# Altium schematic sheet Stepper_Driver_Sheet4.SchDoc
size 420 x 297 mm; SheetNumber: 10; SheetTotal: 14
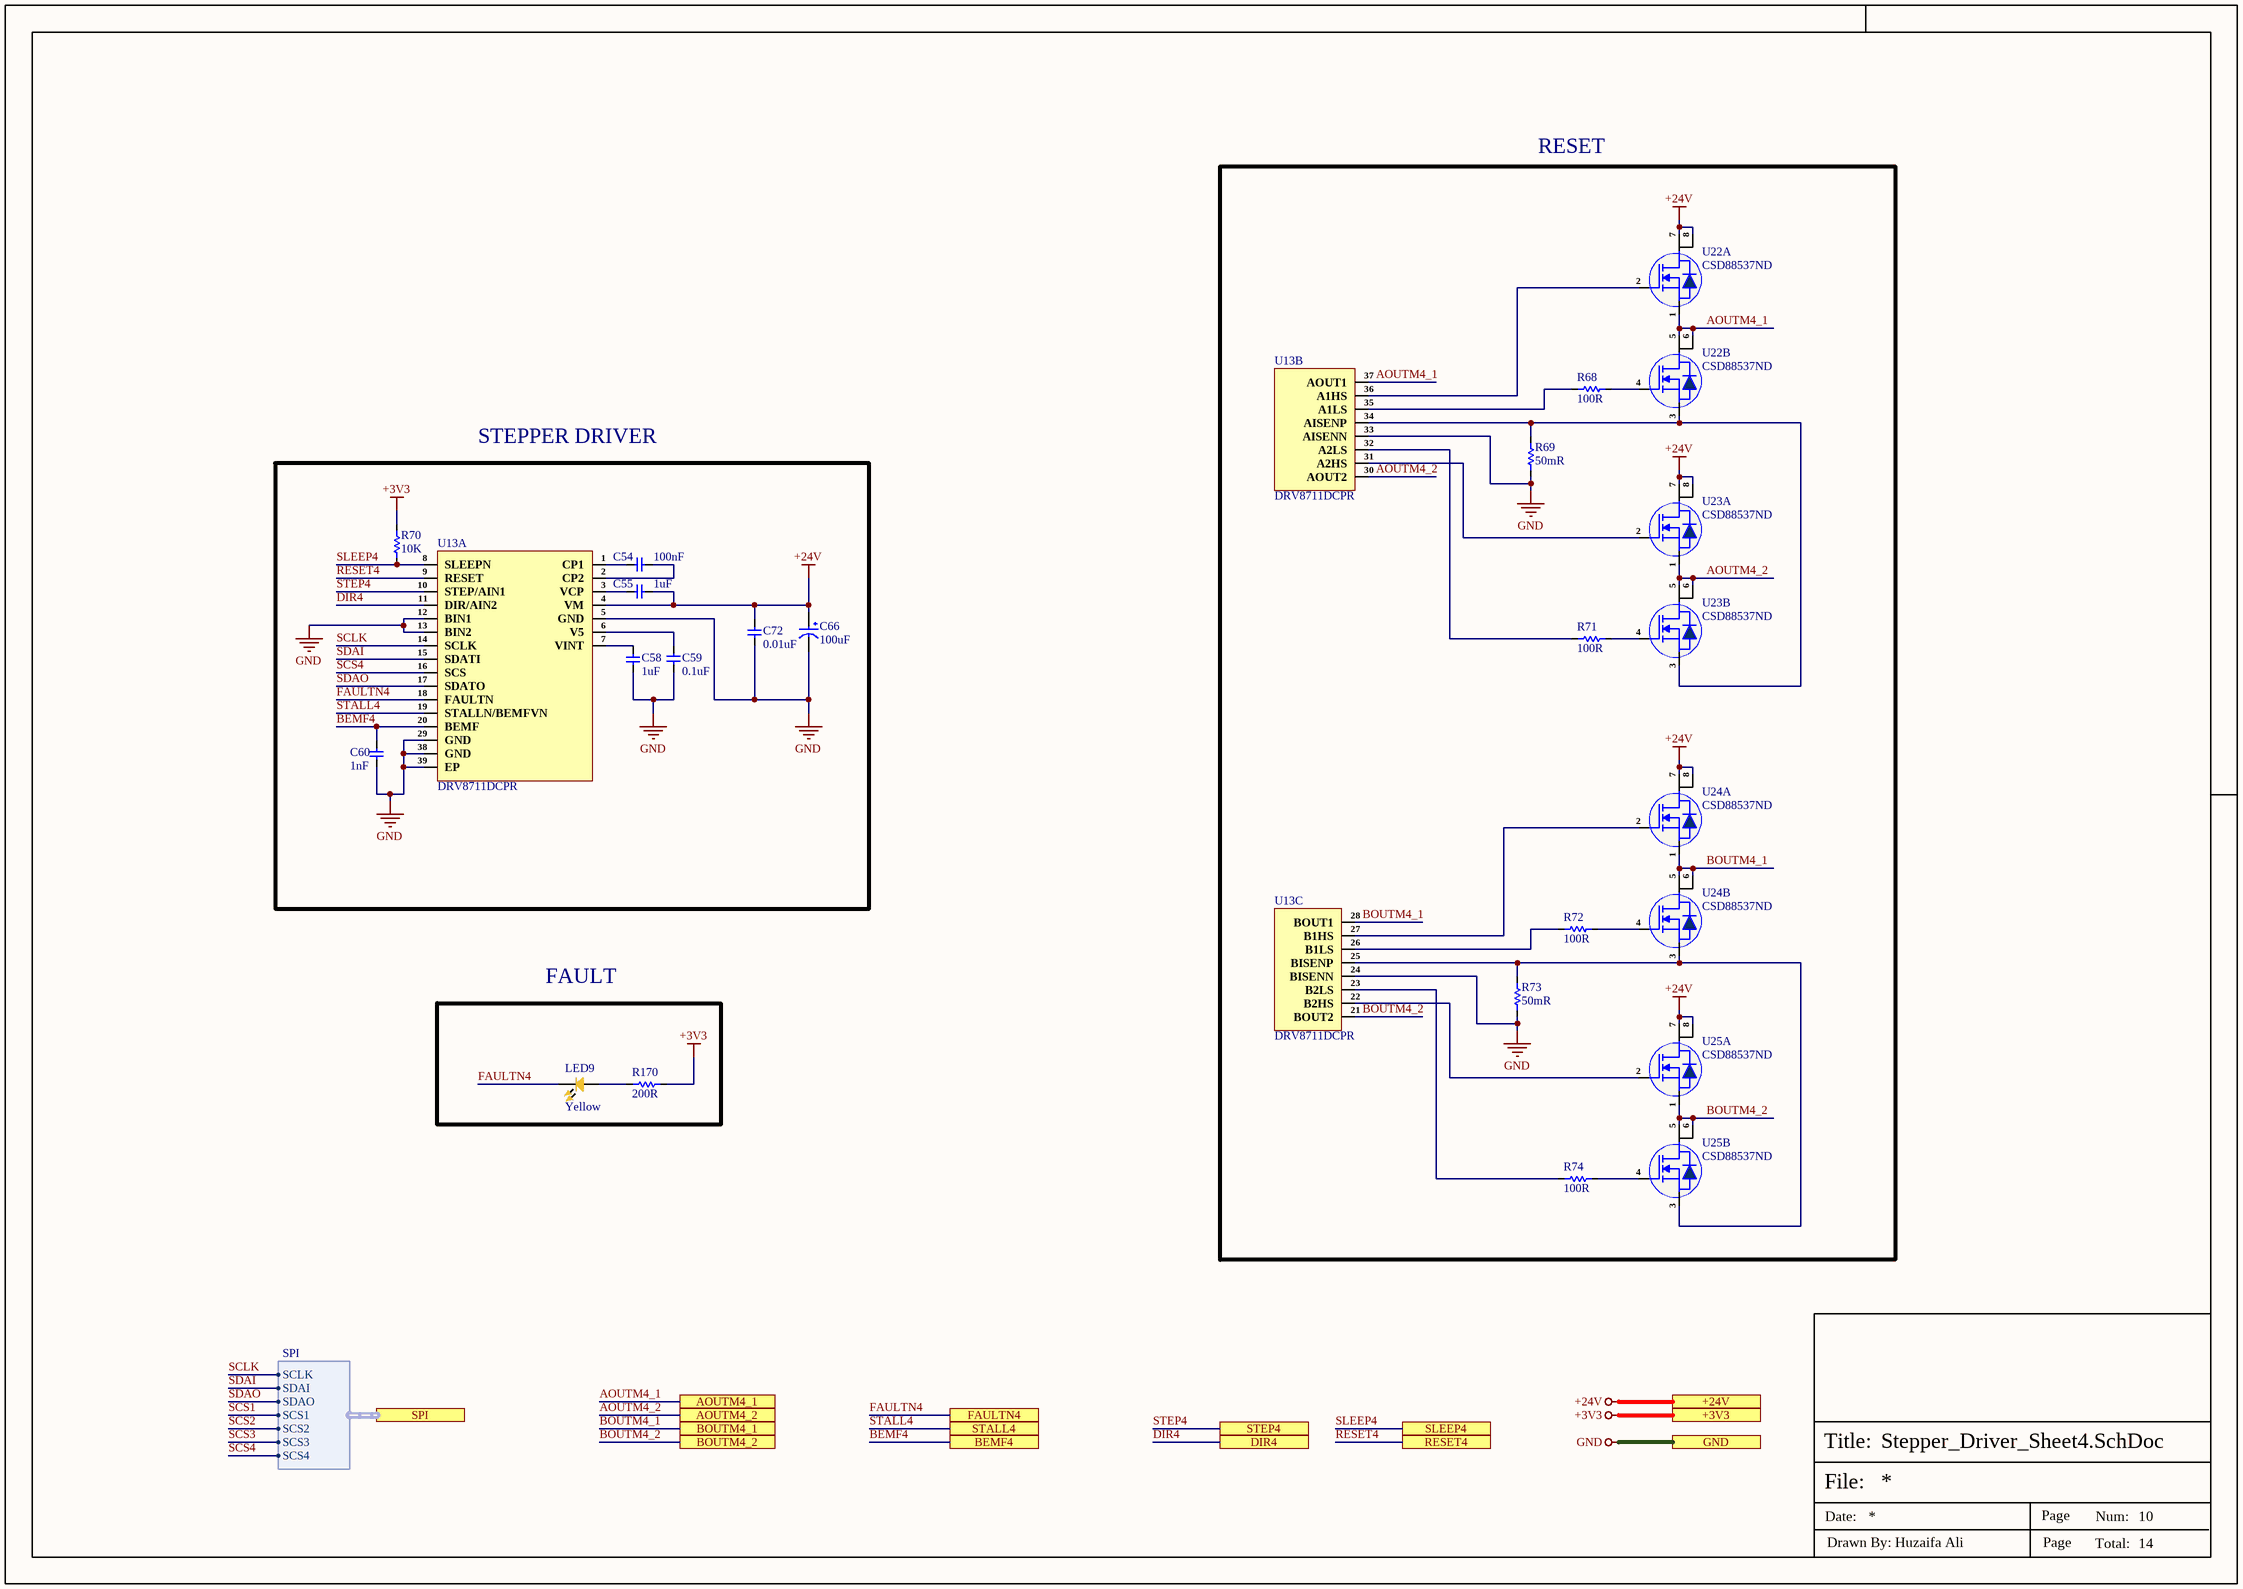
[diagram p0: Stepper_Driver_Sheet4.SchDoc]

## Parts
C54  100nF  [cap-0402]
C55  1uF  [Cap-0402]
C58  1uF  [Cap-0402]
C59  0.1uF  [Cap-0402]
C60  1nF  [Cap-0402]
C66  100uF  [UWT1H101MNL1GS_]
C72  0.01uF  [Cap-0603]
LED9  Yellow  [LED-0603]
R68  100R  [Res-0402]
R69  50mR  [RES-2010]
R70  10K  [Res-0402]
R71  100R  [Res-0402]
R72  100R  [Res-0402]
R73  50mR  [RES-2010]
R74  100R  [Res-0402]
R170  200R  [Res-0402]
U13  DRV8711DCPR  [HTSSOP-38-EP-4.4mm]  (parts A,B,C of 3)
U22  CSD88537ND  [SOIC-8]  (parts A,B of 2)
U23  CSD88537ND  [SOIC-8]  (parts A,B of 2)
U24  CSD88537ND  [SOIC-8]  (parts A,B of 2)
U25  CSD88537ND  [SOIC-8]  (parts A,B of 2)

## Blocks framed on the sheet
RESET: R68 R69 R71-R74 U13 U22-U25
STEPPER DRIVER: C54 C55 C58-C60 C66 C72 R70 U13
FAULT: LED9 R170

## Ports
+3V3 (see Top_Sheet[6B], CAN_Sheet[5D], Controller_Sheet[5D], EtherCAT_Sheet[5D], GPIO_EXPANDER_Sheet[5D], Power_Sheet[5D], RJ45_Sheet[5D], RS485_RS232_Sheet[2D], Stepper_Driver_Sheet1[5D], Stepper_Driver_Sheet2[5D], Stepper_Driver_Sheet3[5D]), +24V (see Top_Sheet[6B], Connector_Sheet[5D], Power_Sheet[5D], Stepper_Driver_Sheet1[5D], Stepper_Driver_Sheet2[5D], Stepper_Driver_Sheet3[5D]), AOUTM4_1 (see Top_Sheet[6B], Connector_Sheet[2D]), AOUTM4_2 (see Top_Sheet[6B], Connector_Sheet[2D]), BEMF4 (see Top_Sheet[6B], Controller_Sheet[4D]), BOUTM4_1 (see Top_Sheet[6C], Connector_Sheet[2D]), BOUTM4_2 (see Top_Sheet[6C], Connector_Sheet[2D]), DIR4 (see Top_Sheet[6B], Controller_Sheet[4D]), FAULTN4 (see Top_Sheet[6B], GPIO_EXPANDER_Sheet[2D]), GND (see Top_Sheet[6B], CAN_Sheet[5D], Connector_Sheet[5D], Controller_Sheet[5D], DIO_Isolation_Sheet[5D], EtherCAT_Sheet[5D], GPIO_EXPANDER_Sheet[5D], Power_Sheet[5D], RJ45_Sheet[5D], RS485_RS232_Sheet[2D], Stepper_Driver_Sheet1[5D], Stepper_Driver_Sheet2[5D], Stepper_Driver_Sheet3[5D]), RESET4 (see Top_Sheet[6B], GPIO_EXPANDER_Sheet[3D]), SLEEP4 (see Top_Sheet[6C], GPIO_EXPANDER_Sheet[3D]), SPI (harness SPI, see Top_Sheet[6B], Controller_Sheet[1D], GPIO_EXPANDER_Sheet[1D], Stepper_Driver_Sheet1[1D], Stepper_Driver_Sheet2[1D], Stepper_Driver_Sheet3[1D]), STALL4 (see Top_Sheet[6B], GPIO_EXPANDER_Sheet[2D]), STEP4 (see Top_Sheet[6B], Controller_Sheet[4D])

## Harnesses
SPI: SCLK, SDAI, SDAO, SCS1, SCS2, SCS3, SCS4

## Nets
+3V3: R70.1 R170.2 ; port +3V3
+24V: C55.2 C66.1 C72.2 U13.4(VM) U22.7(D1) U22.8(D1) U23.7(D1) U23.8(D1) U24.7(D1) U24.8(D1) U25.7(D1) U25.8(D1) ; port +24V
GND: C58.1 C59.2 C60.1 C66.2 C72.1 R69.1 R73.1 U13.5(GND) U13.12(BIN1) U13.13(BIN2) U13.24(BISENN) U13.29(GND) U13.33(AISENN) U13.38(GND) U13.39(EP) ; port GND
AOUTM4_1: U13.37(AOUT1) U22.1(S1) U22.5(D2) U22.6(D2) ; port AOUTM4_1
AOUTM4_2: U13.30(AOUT2) U23.1(S1) U23.5(D2) U23.6(D2) ; port AOUTM4_2
BEMF4: C60.2 U13.20(BEMF) ; port BEMF4
BOUTM4_1: U13.28(BOUT1) U24.1(S1) U24.5(D2) U24.6(D2) ; port BOUTM4_1
BOUTM4_2: U13.21(BOUT2) U25.1(S1) U25.5(D2) U25.6(D2) ; port BOUTM4_2
DIR4: U13.11(DIR/AIN2) ; port DIR4
FAULTN4: LED9.2 U13.18(FAULTN) ; port FAULTN4
RESET4: U13.9(RESET) ; port RESET4
SCLK: U13.14(SCLK) ; port SPI.SCLK
SCS1: port SPI.SCS1
SCS2: port SPI.SCS2
SCS3: port SPI.SCS3
SCS4: U13.16(SCS) ; port SPI.SCS4
SDAI: U13.15(SDATI) ; port SPI.SDAI
SDAO: U13.17(SDATO) ; port SPI.SDAO
SLEEP4: R70.2 U13.8(SLEEPN) ; port SLEEP4
STALL4: U13.19(STALLN/BEMFVN) ; port STALL4
STEP4: U13.10(STEP/AIN1) ; port STEP4
NetC54_1: C54.1 U13.1(CP1)
NetC54_2: C54.2 U13.2(CP2)
NetC55_1: C55.1 U13.3(VCP)
NetC58_2: C58.2 U13.7(VINT)
NetC59_1: C59.1 U13.6(V5)
NetLED9_1: LED9.1 R170.1
NetR68_1: R68.1 U13.35(A1LS)
NetR68_2: R68.2 U22.4(G4)
NetR69_2: R69.2 U13.34(AISENP) U22.3(S2) U23.3(S2)
NetR71_1: R71.1 U13.32(A2LS)
NetR71_2: R71.2 U23.4(G4)
NetR72_1: R72.1 U13.26(B1LS)
NetR72_2: R72.2 U24.4(G4)
NetR73_2: R73.2 U13.25(BISENP) U24.3(S2) U25.3(S2)
NetR74_1: R74.1 U13.23(B2LS)
NetR74_2: R74.2 U25.4(G4)
NetU13_22: U13.22(B2HS) U25.2(G1)
NetU13_27: U13.27(B1HS) U24.2(G1)
NetU13_31: U13.31(A2HS) U23.2(G1)
NetU13_36: U13.36(A1HS) U22.2(G1)

## Notes on the sheet
- File:
- Title:
- Date:
- Page
- Num:
- Total:
- Drawn By: Huzaifa Ali

## Library data of the parts
C54 = C1005X7R1H104KT000F: CAP CER 0.1UF 50V X7R 0402; Manufacturer: TDK; Tolerance: 10%; Voltage: 25V; Item Type: Capacitor; Supplier 1: Avnet; Manufacturer Part Number: C1005X7R1H104KT000F; RoHS: No; Category: Ceramic Capacitors; Dielectric: X7R; Supplier Part Number 1: C1005X7R1H104KT000F; LCSC Part Number: C361198; ComponentLink1Description: LCSC; ComponentLink1URL: https://www.lcsc.com/product-detail/Multilayer-Ceramic-Capacitors-MLCC-SMD-SMT_TDK-C1005X7R1H104KT000F_C361198.html
C55 C58 = CC0402KRX5R6BB105: CAP CER 1UF 10V X5R 0402; Manufacturer: Yageo; Tolerance: 10%; Dissipation Factor: 15%; Item Type: Capacitor; Supplier 1: Mouser; Manufacturer Part Number: CC0402KRX5R6BB105; RoHS: Yes; Category: Ceramic Capacitors; Stock 1: 6711367; Pricing 1: 1=0.11000, 10=0.05500, 50=0.05500, 100=0.03300, 500=0.02700, 1000=0.02200, 2500=0.02100, 10000=0.01800 (USD); Mount: Surface Mount; Case/Package: 0402; Number of Pins: 2; Case Code (Metric): 1005; Case Code (Imperial): 0402; Min Operating Temperature: -55°C; Max Operating Temperature: 85°C; Capacitance: 1uF; Dielectric: X5R; Package Quantity: 1; Voltage Rating: 10V; Packaging: Tape and Reel; Voltage Rating (DC): 10V; Termination: SMD/SMT; Resistor Type: Ceramic; Series: CC; Construction: Flat; Length: 1mm; Width: 0.02inch; Height: 0.5mm; Thickness: 0.022inch; Depth: 0.5mm; Radiation Hardening: No; REACH SVHC: No SVHC; Lead Free: Lead Free; Halogen Free: Halogen Free; RoHS Compliant: Yes; ComponentLink1URL: https://datasheet.ciiva.com/176/upy-gphc-x5r-4v-to-50v-12-176704.pdf?src-supplier=Digi-Key; ComponentLink1Description: https://datasheet.ciiva.com/176/upy-gphc-x5r-4v-to-50v-12-176704.pdf?src-supplier=Digi-Key; ComponentLink2URL: https://datasheet.ciiva.com/176/mlccorderingcode-176705.pdf?src-supplier=Digi-Key; ComponentLink2Description: https://datasheet.ciiva.com/176/mlccorderingcode-176705.pdf?src-supplier=Digi-Key; ComponentLink3URL: https://datasheet.ciiva.com/176/mlccorderingcode-176706.pdf?src-supplier=Digi-Key; ComponentLink3Description: https://datasheet.ciiva.com/176/mlccorderingcode-176706.pdf?src-supplier=Digi-Key; Supplier Part Number 1: 603-CC402KRX5R6BB105; LCSC Part Number: C106254
C59 = CC0402JRX7R7BB104: CAP CER 0.1UF 16V X7R 0402; Manufacturer: Yageo; Material: 4241ConductorMaterial; Value: 100nF; Tolerance: 5%; Item Type: Capacitor; Supplier: Digikey; Supplier Part Number: 311-1676-1-ND; Manufacturer Part Number: CC0402JRX7R7BB104; RoHS: Yes; Category: Ceramic Capacitors; Stock: 1659111; Pricing: 1=0.1, 10=0.046, 50=0.0262, 100=0.0203, 500=0.01528, 1000=0.012, 2500=0.01091, 5000=0.01004 (USD); Mounting Technology: Surface Mount; Case/Package: 0402; Case Code (Metric): 1005; Case Code (Imperial): 0402; Min Operating Temperature: -55°C; Max Operating Temperature: 125°C; Dielectric: X7R; Packaging: Tape and Reel; Package Quantity: 10000; Voltage Rating (DC): 16V; Voltage Rating: 16V; Series: CC; Construction: Flat; Length: 0.039inch; Width: 0.02inch; Height: 0.5mm; Thickness: 0.022inch; Lead Free: Lead Free; Halogen Free: Halogen Free; RoHS Compliant: Yes; ComponentLink1URL: https://datasheet.ciiva.com/13210/upy-gphc-x7r-6-3v-to-50v-8-12304-13210152.pdf?src-supplier=Mouser; ComponentLink1Description: https://datasheet.ciiva.com/13210/upy-gphc-x7r-6-3v-to-50v-8-12304-13210152.pdf?src-supplier=Mouser; LCSC Part Number: C541464
C60 = C1005C0G1E102JT000F: CAP CER 1000PF 25V C0G 0402; Manufacturer: TDK; Item Type: Capacitor; ComponentLink1Description: LCSC; ComponentLink1URL: https://www.lcsc.com/product-detail/Multilayer-Ceramic-Capacitors-MLCC-SMD-SMT_TDK-C1005C0G1E102JT000F_C343059.html; Manufacturer Part Number: C1005C0G1E102JT000F; Package: 0402; LCSC Part Number: C343059
C66 = UWT1H101MNL1GS: CAP ALUM 100UF 20% 50V SMD; Manufacturer: Nichicon; Dielectric Material: Aluminium; Ripple Current: 140mA; Leakage Current: 3uA; Life (Hours): 1000Hour; Dissipation Factor: 0.14%; Item Type: Capacitor; Supplier 1: Digi-Key; Manufacturer Part Number: UWT1H101MNL1GS; Stock 1: 24169; Pricing 1: 1=0.57, 10=0.405, 50=0.3058, 100=0.2664 (USD); Mount: Surface Mount; Case/Package: Radial; Number of Pins: 2; Min Operating Temperature: -55°C; Max Operating Temperature: 105°C; Capacitance: 100uF; Tolerance: 20%; Package Quantity: 500; Voltage Rating: 50V; Packaging: Tape and Reel; Ripple Current (AC): 140mA; Voltage Rating (DC): 50V; Termination: SMD/SMT; Voltage: 50V; Series: WT; Construction: Cylindrical; Diameter: 8mm; Length: 10mm; Height: 10mm; Height - Seated (Max): 0.413inch; Radiation Hardening: No; REACH SVHC: No SVHC; Lead Free: Lead Free; RoHS Compliant: Yes; ComponentLink1URL: http://www.farnell.com/datasheets/2100058.pdf?src-supplier=Element14; ComponentLink1Description: http://www.farnell.com/datasheets/2100058.pdf?src-supplier=Element14; ComponentLink2URL: http://www.farnell.com/datasheets/2576809.pdf?src-supplier=Element14; ComponentLink2Description: http://www.farnell.com/datasheets/2576809.pdf?src-supplier=Element14; ComponentLink3URL: http://www.nichicon.co.jp/english/products/pdfs/e-ch_ref.pdf?src-supplier=Digi-Key; ComponentLink3Description: http://www.nichicon.co.jp/english/products/pdfs/e-ch_ref.pdf?src-supplier=Digi-Key; ComponentLink4URL: http://www.mouser.com/ds/2/293/e-wt-30307.pdf?src-supplier=Mouser; ComponentLink4Description: http://www.mouser.com/ds/2/293/e-wt-30307.pdf?src-supplier=Mouser; ComponentLink5URL: http://uk.rs-online.com/webdocs/13ec/0900766b813ecfdc.pdf?src-supplier=RSComponents; ComponentLink5Description: http://uk.rs-online.com/webdocs/13ec/0900766b813ecfdc.pdf?src-supplier=RSComponents; ComponentLink6URL: http://www.nichicon.co.jp/english/products/pdfs/e-wt.pdf?src-supplier=Avnet; ComponentLink6Description: http://www.nichicon.co.jp/english/products/pdfs/e-wt.pdf?src-supplier=Avnet; ComponentLink7URL: http://products.nichicon.co.jp/en/pdf/XJA043/e-wt.pdf?src-supplier=Future+Electronics; ComponentLink7Description: http://products.nichicon.co.jp/en/pdf/XJA043/e-wt.pdf?src-supplier=Future+Electronics; ComponentLink8URL: http://www.nichicon.co.jp/english/products/pdfs/e-wt.pdf?src-supplier=Avnet+Europe; ComponentLink8Description: http://www.nichicon.co.jp/english/products/pdfs/e-wt.pdf?src-supplier=Avnet+Europe; Supplier Part Number 1: 493-2226-1-ND; LCSC Part Number: C445063
C72 = GRM1885C1H103JA01D: CAP CER 10000PF 50V C0G/NP0 0603; Manufacturer: Murata; Material: Ceramic; Capacitance: 10nF; Tolerance: 5%; Dielectric: C0G; Supplier 1: RSComponents; Manufacturer Part Number: GRM1885C1H103JA01D; RoHS: Yes; Category: Ceramic Capacitors; Stock 1: 80000; Pricing 1: 4000=0.03500, 8000=0.03200 (GBP); Mount: Surface Mount; Case/Package: 0603; Case Code (Metric): 1608; Case Code (Imperial): 0603; Min Operating Temperature: -55°C; Max Operating Temperature: 125°C; Packaging: Tape and Reel; Package Quantity: 4000; Voltage Rating: 50V; Voltage Rating (DC): 50V; Termination: SMD/SMT; Voltage: 50V; Series: GRM; Length: 1.6mm; Width: 0.8mm; Height: 0.8mm; Thickness: 0.035inch; Lead Pitch: 0.5mm; Depth: 0.8mm; REACH SVHC: No SVHC; Lead Free: Lead Free; RoHS Compliant: Yes; ComponentLink1URL: https://datasheet.ciiva.com/41860/partnumbering-e-01-41860759.pdf?src-supplier=Digi-Key; ComponentLink1Description: https://datasheet.ciiva.com/41860/partnumbering-e-01-41860759.pdf?src-supplier=Digi-Key; ComponentLink2URL: https://datasheet.ciiva.com/29537/partnumbering-e-01-29537910.pdf?src-supplier=Digi-Key; ComponentLink2Description: https://datasheet.ciiva.com/29537/partnumbering-e-01-29537910.pdf?src-supplier=Digi-Key; Supplier Part Number 1: 1449032
LED9 = NCD0603Y2: yellow 0603 Light Emitting Diodes (LED) ROHS; Manufacturer: Foshan NationStar Optoelectronics; Manufacturer Part Number: NCD0603Y2; Package: 0603; LCSC Part Number: C89811; Item Type: LED; ComponentLink1Description: LCSC; ComponentLink1URL: https://www.lcsc.com/product-detail/Light-Emitting-Diodes-LED_Foshan-NationStar-Optoelectronics-NCD0603Y2_C89811.html
R68 R71 R72 R74 = RC0402FR-07100RL: RES 100 OHM 1% 1/16W 0402; Manufacturer: Yageo; Power Rating: 62.5mW; Voltage Rating: 50V; Temperature Coefficient: 100ppm/°C; Max Power Dissipation: 63mW; Item Type: Resistor; Supplier 1: Mouser; Manufacturer Part Number: RC0402FR-07100RL; RoHS: Yes; Category: Chip SMD Resistors; Stock 1: 699545; Pricing 1: 1=0.10000, 10=0.01200, 50=0.01200, 100=0.00500, 1000=0.00300, 2500=0.00200, 10000=0.00100 (USD); Case/Package: 0402; Number of Pins: 2; Case Code (Imperial): 0402; Case Code (Metric): 1005; Size Code: 0402; Min Operating Temperature: -55°C; Max Operating Temperature: 155°C; Tolerance: 1%; Voltage Rating (DC): 50V; Resistance: 100R; Packaging: Tape and Reel; Termination: SMD/SMT; Resistor Type: Thick Film; Features: Moisture Resistant; Series: RC; Number of Terminations: 2; Resistance Tolerance: 1%; Construction: Rectangular; Technology: THICK FILM; Length: 1mm; Width: 0.5mm; Height: 0.32mm; Depth: 0.5mm; RoHS Compliant: Yes; REACH SVHC: No SVHC; Military Standard: Not; Lead Free: Lead Free; ComponentLink1URL: https://datasheet.ciiva.com/11808/0900766b80c66297-11808765.pdf?src-supplier=RSComponents; ComponentLink1Description: https://datasheet.ciiva.com/11808/0900766b80c66297-11808765.pdf?src-supplier=RSComponents; ComponentLink2URL: https://datasheet.ciiva.com/7849/1784430-7849810.pdf?src-supplier=Element14; ComponentLink2Description: https://datasheet.ciiva.com/7849/1784430-7849810.pdf?src-supplier=Element14; ComponentLink3URL: https://datasheet.ciiva.com/28367/1018594-28367226.pdf?src-supplier=Element14; ComponentLink3Description: https://datasheet.ciiva.com/28367/1018594-28367226.pdf?src-supplier=Element14; ComponentLink4URL: https://datasheet.ciiva.com/22747/1018594-22747511.pdf?src-supplier=Element14; ComponentLink4Description: https://datasheet.ciiva.com/22747/1018594-22747511.pdf?src-supplier=Element14; ComponentLink5URL: https://datasheet.ciiva.com/12667/pyu-rc0402-51-rohs-l-6-r-12667957.pdf?src-supplier=Mouser; ComponentLink5Description: https://datasheet.ciiva.com/12667/pyu-rc0402-51-rohs-l-6-r-12667957.pdf?src-supplier=Mouser; ComponentLink6URL: https://datasheet.ciiva.com/15189/getdatasheetpartid-329466-15189335.pdf?src-supplier=Verical; ComponentLink6Description: https://datasheet.ciiva.com/15189/getdatasheetpartid-329466-15189335.pdf?src-supplier=Verical; ComponentLink7URL: https://datasheet.ciiva.com/16740/pyu-rc0402-51-rohs-l-6-r-16740566.pdf?src-supplier=Future+Electronics; ComponentLink7Description: https://datasheet.ciiva.com/16740/pyu-rc0402-51-rohs-l-6-r-16740566.pdf?src-supplier=Future+Electronics; Supplier Part Number 1: 603-RC0402FR-07100RL; LCSC Part Number: C106232
R69 R73 = RLM20FECR050: 1W 50mΩ Surface Mount Current Sensing Resistors ±50ppm/℃ ±1% 2010 Current Sense Resistors/Shunt Resistors ROHS; Manufacturer: TA-I Tech; Manufacturer Part Number: RLM20FECR050; Package: 2010; LCSC Part Number: C912938; Item Type: Shunt Resistor; ComponentLink1Description: LCSC; ComponentLink1URL: https://www.lcsc.com/product-detail/Current-Sense-Resistors-Shunt-Resistors_TA-I-Tech-RLM20FECR050_C912938.html
R70 = RC0402FR-0710KL: RES 10K OHM 1% 1/16W 0402; Manufacturer: Yageo; Resistance: 10kR; Voltage Rating (DC): 50V; Temperature Coefficient: 100ppm/°C; Power Rating: 62.5mW; Max Power Dissipation: 63mW; Item Type: Resistor; Supplier 1: Mouser; Manufacturer Part Number: RC0402FR-0710KL; RoHS: Yes; Category: Chip SMD Resistors; Stock 1: 18648329; Pricing 1: 1=0.10000, 10=0.01400, 50=0.01400, 100=0.00500, 1000=0.00300, 10000=0.00200 (USD); Case/Package: 0402; Number of Pins: 2; Case Code (Imperial): 0402; Case Code (Metric): 1005; Min Operating Temperature: -55°C; Max Operating Temperature: 155°C; Resistor Type: Thick Film; Tolerance: 1%; Packaging: Tape and Reel; Voltage Rating: 50V; Termination: SMD/SMT; Working Voltage: 50V; Number of Terminations: 2; Features: Moisture Resistant; Series: RC; Resistance Tolerance: 1%; Construction: Rectangular; Length: 1mm; Width: 0.5mm; Height: 0.32mm; Depth: 0.5mm; Lead Pitch: 0.2mm; REACH SVHC: No SVHC; Lead Free: Lead Free; RoHS Compliant: Yes; Military Standard: Not; ComponentLink1URL: https://datasheet.ciiva.com/7660/38568-7660787.pdf?src-supplier=Element14; ComponentLink1Description: https://datasheet.ciiva.com/7660/38568-7660787.pdf?src-supplier=Element14; ComponentLink2URL: https://datasheet.ciiva.com/7849/1686128-7849814.pdf?src-supplier=Element14; ComponentLink2Description: https://datasheet.ciiva.com/7849/1686128-7849814.pdf?src-supplier=Element14; ComponentLink3URL: https://datasheet.ciiva.com/7983/1018594-7983486.pdf?src-supplier=Element14; ComponentLink3Description: https://datasheet.ciiva.com/7983/1018594-7983486.pdf?src-supplier=Element14; ComponentLink4URL: https://datasheet.ciiva.com/22747/1018594-22747512.pdf?src-supplier=Element14; ComponentLink4Description: https://datasheet.ciiva.com/22747/1018594-22747512.pdf?src-supplier=Element14; ComponentLink5URL: https://datasheet.ciiva.com/12667/pyu-rc0402-51-rohs-l-6-r-12667067.pdf?src-supplier=Mouser; ComponentLink5Description: https://datasheet.ciiva.com/12667/pyu-rc0402-51-rohs-l-6-r-12667067.pdf?src-supplier=Mouser; ComponentLink6URL: https://datasheet.ciiva.com/7849/1784430-7849813.pdf?src-supplier=Element14; ComponentLink6Description: https://datasheet.ciiva.com/7849/1784430-7849813.pdf?src-supplier=Element14; ComponentLink7URL: https://datasheet.ciiva.com/7849/1784430-7849815.pdf?src-supplier=Element14; ComponentLink7Description: https://datasheet.ciiva.com/7849/1784430-7849815.pdf?src-supplier=Element14; Supplier Part Number 1: 603-RC0402FR-0710KL; LCSC Part Number: C60490
R170 = RC0402FR-07200RL: RES 200 OHM 1% 1/16W 0402; Manufacturer: Yageo; Temperature Coefficient: 100ppm/°C; Power Rating: 63mW; Voltage Rating (DC): 50V; Supplier 1: Digi-Key; Manufacturer Part Number: RC0402FR-07200RL; RoHS: Yes; Category: Chip SMD Resistors; Stock 1: 19778; Pricing 1: 1=0.10000, 10=0.01600, 100=0.00660, 1000=0.00299, 2500=0.00259, 5000=0.00214 (USD); Case/Package: 0402; Case Code (Metric): 1005; Case Code (Imperial): 0402; Size Code: 0402; Min Operating Temperature: -55°C; Max Operating Temperature: 155°C; Tolerance: 1%; Resistance: 200R; Resistor Type: Thick Film; Packaging: Tape and Reel; Voltage Rating: 50V; Package Quantity: 1; Number of Terminations: 2; Termination: SMD/SMT; Max Power Dissipation: 63mW; Features: Moisture Resistant; Series: RC; Construction: Rectangular; Resistance Tolerance: 1%; Length: 1mm; Width: 0.02inch; Height: 0.016inch; Depth: 0.5mm; REACH SVHC: No SVHC; Lead Free: Lead Free; RoHS Compliant: Yes; Military Standard: Not; ComponentLink1URL: https://datasheet.ciiva.com/2553/pyu-r-int-thick-7-2553232.pdf?src-supplier=Digi-Key; ComponentLink1Description: https://datasheet.ciiva.com/2553/pyu-r-int-thick-7-2553232.pdf?src-supplier=Digi-Key; ComponentLink2URL: https://datasheet.ciiva.com/7983/1018594-7983509.pdf?src-supplier=Element14; ComponentLink2Description: https://datasheet.ciiva.com/7983/1018594-7983509.pdf?src-supplier=Element14; ComponentLink3URL: https://datasheet.ciiva.com/16804/pyu-rc0402-51-rohs-l-6-r-16804406.pdf?src-supplier=Future+Electronics; ComponentLink3Description: https://datasheet.ciiva.com/16804/pyu-rc0402-51-rohs-l-6-r-16804406.pdf?src-supplier=Future+Electronics; ComponentLink4URL: https://datasheet.ciiva.com/15189/getdatasheetpartid-331152-15189383.pdf?src-supplier=Verical; ComponentLink4Description: https://datasheet.ciiva.com/15189/getdatasheetpartid-331152-15189383.pdf?src-supplier=Verical; ComponentLink5URL: https://datasheet.ciiva.com/7849/1018594-7849898.pdf?src-supplier=Element14; ComponentLink5Description: https://datasheet.ciiva.com/7849/1018594-7849898.pdf?src-supplier=Element14; ComponentLink6URL: https://datasheet.ciiva.com/5562/pyu-rc0402-51-rohs-l-6-r-8721-5562539.pdf?src-supplier=Mouser; ComponentLink6Description: https://datasheet.ciiva.com/5562/pyu-rc0402-51-rohs-l-6-r-8721-5562539.pdf?src-supplier=Mouser; ComponentLink7URL: https://datasheet.ciiva.com/7849/1018594-7849899.pdf?src-supplier=Element14; ComponentLink7Description: https://datasheet.ciiva.com/7849/1018594-7849899.pdf?src-supplier=Element14; ComponentLink8URL: https://datasheet.ciiva.com/2553/pyu-r-int-thick-7-2553230.pdf?src-supplier=Digi-Key; ComponentLink8Description: https://datasheet.ciiva.com/2553/pyu-r-int-thick-7-2553230.pdf?src-supplier=Digi-Key; ComponentLink9URL: https://datasheet.ciiva.com/2553/pyu-r-int-thick-7-2553231.pdf?src-supplier=Digi-Key; ComponentLink9Description: https://datasheet.ciiva.com/2553/pyu-r-int-thick-7-2553231.pdf?src-supplier=Digi-Key; Supplier Part Number 1: 311-200LRCT-ND; LCSC Part Number: C114764
U13 = DRV8711DCPR: IC MTR DRV BIPOLR 8-52V 38HTSSOP; Manufacturer: Texas Instruments; Output Current: 200mA; Output Voltage: 5V; Min Supply Voltage: 8V; Max Supply Voltage: 52V; Interface: SPI; Supply Current: 17mA; Supplier: Mouser; LCSC Part Number: C60013; Manufacturer Part Number: DRV8711DCPR; RoHS: Yes; Item Type: IC; Stock: 9050; Pricing: 1=4.97, 10=4.29, 50=4.29, 100=3.66, 1000=2.63, 10000=2.48 (USD); Mounting Technology: Surface Mount; Case/Package: HTSSOP; Pins: 38; Min Operating Temperature: -40°C; Max Operating Temperature: 85°C; Packaging: Tape and Reel; Package Quantity: 2000; Series: -; Radiation Hardening: No; Lead Free: Lead Free; RoHS Compliant: Yes; ComponentLink1URL: https://datasheet.ciiva.com/24016/slvsc40d-317294-24016712.pdf?src-supplier=Mouser; ComponentLink1Description: https://datasheet.ciiva.com/24016/slvsc40d-317294-24016712.pdf?src-supplier=Mouser
U22-U25 = CSD88537ND: MOSFET 2N-CH 60V 15A 8SOIC; Manufacturer: Texas Instruments; Item Type: IC; Supplier: Mouser; LCSC Part Number: C117439; Manufacturer Part Number: CSD88537ND; RoHS: Yes; Stock: 24825; Pricing: 1=1.26, 10=1.03, 50=1.03, 100=0.8, 1000=0.552, 10000=0.494 (USD); ComponentLink1URL: https://datasheet.ciiva.com/29589/csd88537nd-29589985.pdf?src-supplier=Digikey; ComponentLink1Description: https://datasheet.ciiva.com/29589/csd88537nd-29589985.pdf?src-supplier=Digikey; ComponentLink2URL: https://datasheet.ciiva.com/46430/1857624-46430364.pdf?src-supplier=Element14; ComponentLink2Description: https://datasheet.ciiva.com/46430/1857624-46430364.pdf?src-supplier=Element14